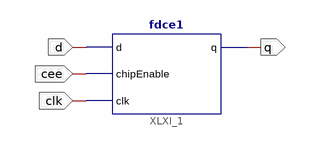
[diagram p0: schematic sheet 1]
// Xilinx ISE schematic prueba.sch (artix7) as structural Verilog: 1 symbols, 4 ports
module prueba (
  input  d,
  input  cee,
  input  clk,
  output q
);

  fdce1 XLXI_1 (.clk(clk), .chipEnable(cee), .d(d), .q(q));
endmodule
